# EasyEDA schematic LM471-2-feb-15.json
TITLE: Sheet_1; REV: 1.0; Date: 2024-01-02; Sheet: 1/1; Company: Your Company
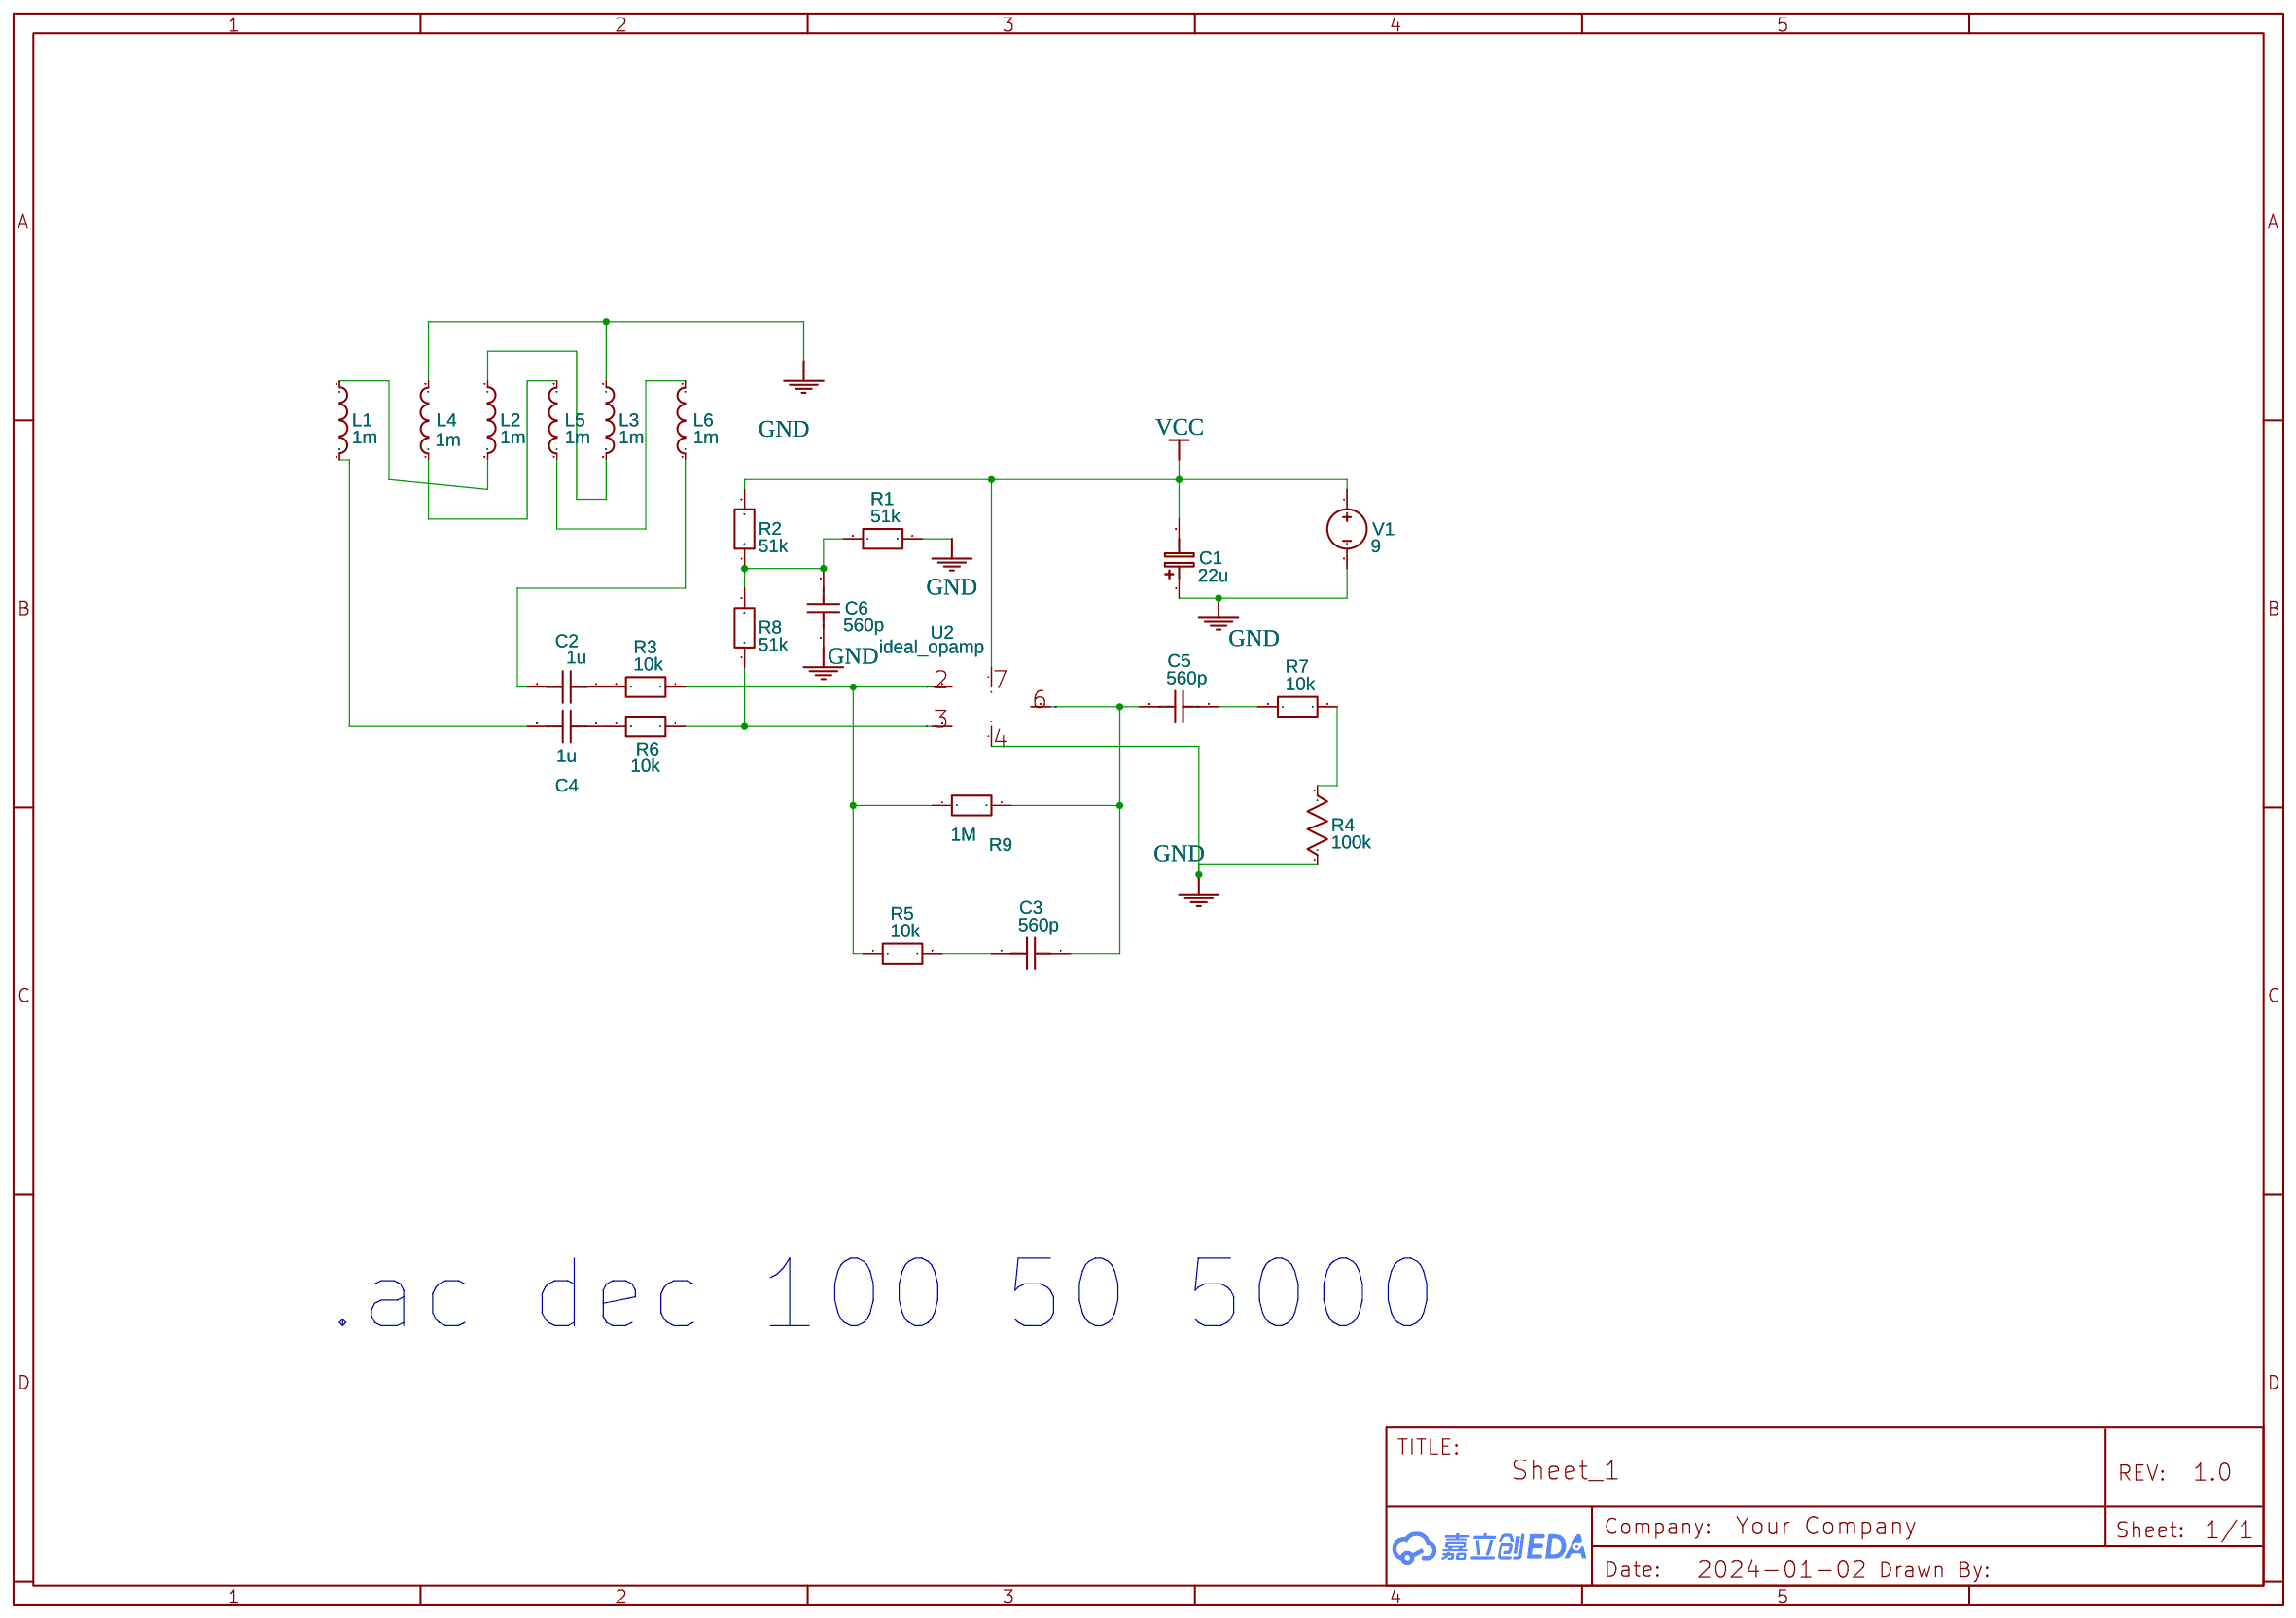
[diagram p0: schematic sheet]

## Parts
C1  22u  [SMD]
C2  1u  [RAD-0.1]
C3  560p  [RAD-0.1]
C4  1u  [RAD-0.1]
C5  560p  [RAD-0.1]
C6  560p  [RAD-0.1]
L1  1m  [COILCRAFT-10MM]
L2  1m  [COILCRAFT UNICOIL 10MM]
L3  1m  [COIL]
L4  1m  [COIL]
L5  1m  [COIL]
L6  1m  [COIL]
R1  51k  [R0603]
R2  51k  [R0603]
R3  10k  [R0603]
R4  100k  [AXIAL-0.3]
R5  10k  [R0603]
R6  10k  [R0603]
R7  10k  [R0603]
R8  51k  [R0603]
R9  1M  [R0603]
U2  ideal_opamp  [TL071H]
V1  9  [HDR1X2]

## Library data of the parts
C1 = C_Tan_SMD_A_EU: Contributor: LCEDA_Lib
C2 C4 = Capacitor_US: Contributor: EasyEDA; Supplier: YUJING
C3 C5 C6 = Capacitor_US: Contributor: EasyEDA; Supplier: YUJING; Capacitance: 1u
L1-L6 = L0603_US: Contributor: LCEDA_Lib
R1-R3 R5-R9 = R_0603_EU: Contributor: LCEDA_Lib
R4 = Resistor_US: Resistance: 1k; Contributor: EasyEDA; Supplier: YUJING
U2 = LM741: Contributor: juan_g2; sim: true
V1 = VDC: Contributor: EasyEDA; sim: true

## Nets
GND: C1.1 C6.2 L3.1 L4.2 R1.1 R4.1 U2.4(V-) V1.2
VCC: C1.2 R2.2 U2.7(V+) V1.1
Net-(C2-1): C2.1 R3.2
Net-(C2-2): C2.2 L6.1
Net-(C3-1): C3.1 C5.2 R9.2 U2.6(OUT)
Net-(C3-2): C3.2 R5.2
Net-(C4-1): C4.1 R6.2
Net-(C4-2): C4.2 L1.2
Net-(C5-1): C5.1 R7.1
Net-(C6-1): C6.1 R1.2 R2.1 R8.2
Net-(L1-1): L1.1 L2.2
Net-(L2-1): L2.1 L3.2
Net-(L4-1): L4.1 L5.2
Net-(L5-1): L5.1 L6.2
Net-(R3-1): R3.1 R5.1 R9.1 U2.2(IN-)
Net-(R4-2): R4.2 R7.2
Net-(R6-1): R6.1 R8.1 U2.3(IN+)

## Notes on the sheet
- .ac dec 100 50 5000
